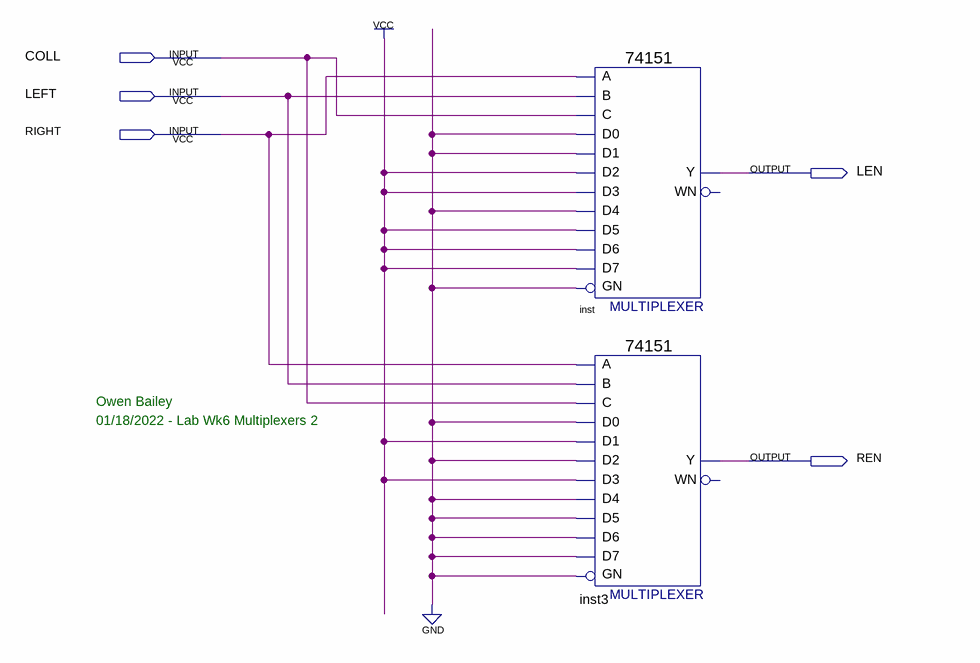
[diagram p0: schematic sheet]
// Quartus schematic digibotmux2.bdf as structural Verilog: 2 symbols, 5 pins
module digibotmux2 (
  input  COLL,
  input  LEFT,
  input  RIGHT,
  output LEN,
  output REN
);

  \74151  inst (
    .GN(1'b0), .C(COLL), .B(LEFT), .A(RIGHT), .D5(1'b1), .D0(1'b0), .D1(1'b0), .D4(1'b0), .D3(1'b1),
    .D2(1'b1), .D6(1'b1), .D7(1'b1), .Y(LEN));  // open: WN
  \74151  inst3 (
    .GN(1'b0), .C(COLL), .B(LEFT), .A(RIGHT), .D5(1'b0), .D0(1'b0), .D1(1'b1), .D4(1'b0), .D3(1'b1),
    .D2(1'b0), .D6(1'b0), .D7(1'b0), .Y(REN));  // open: WN

  // Notes on the sheet:
  //   Owen Bailey
  //   01/18/2022 - Lab Wk6 Multiplexers 2
endmodule
